# Altium schematic sheet keymap.SchDoc: Keymap Layout
size A3; Author: Daniele Basile <asterix24@gmail.com>; Organization: Altium Limited; Address1: L3, 12a Rodborough Rd; Address2: Frenchs Forest; Address3: NSW; Address4: Australia 2086; DocumentNumber: 2; Revision: Rev.A; SheetNumber: 2; SheetTotal: 2
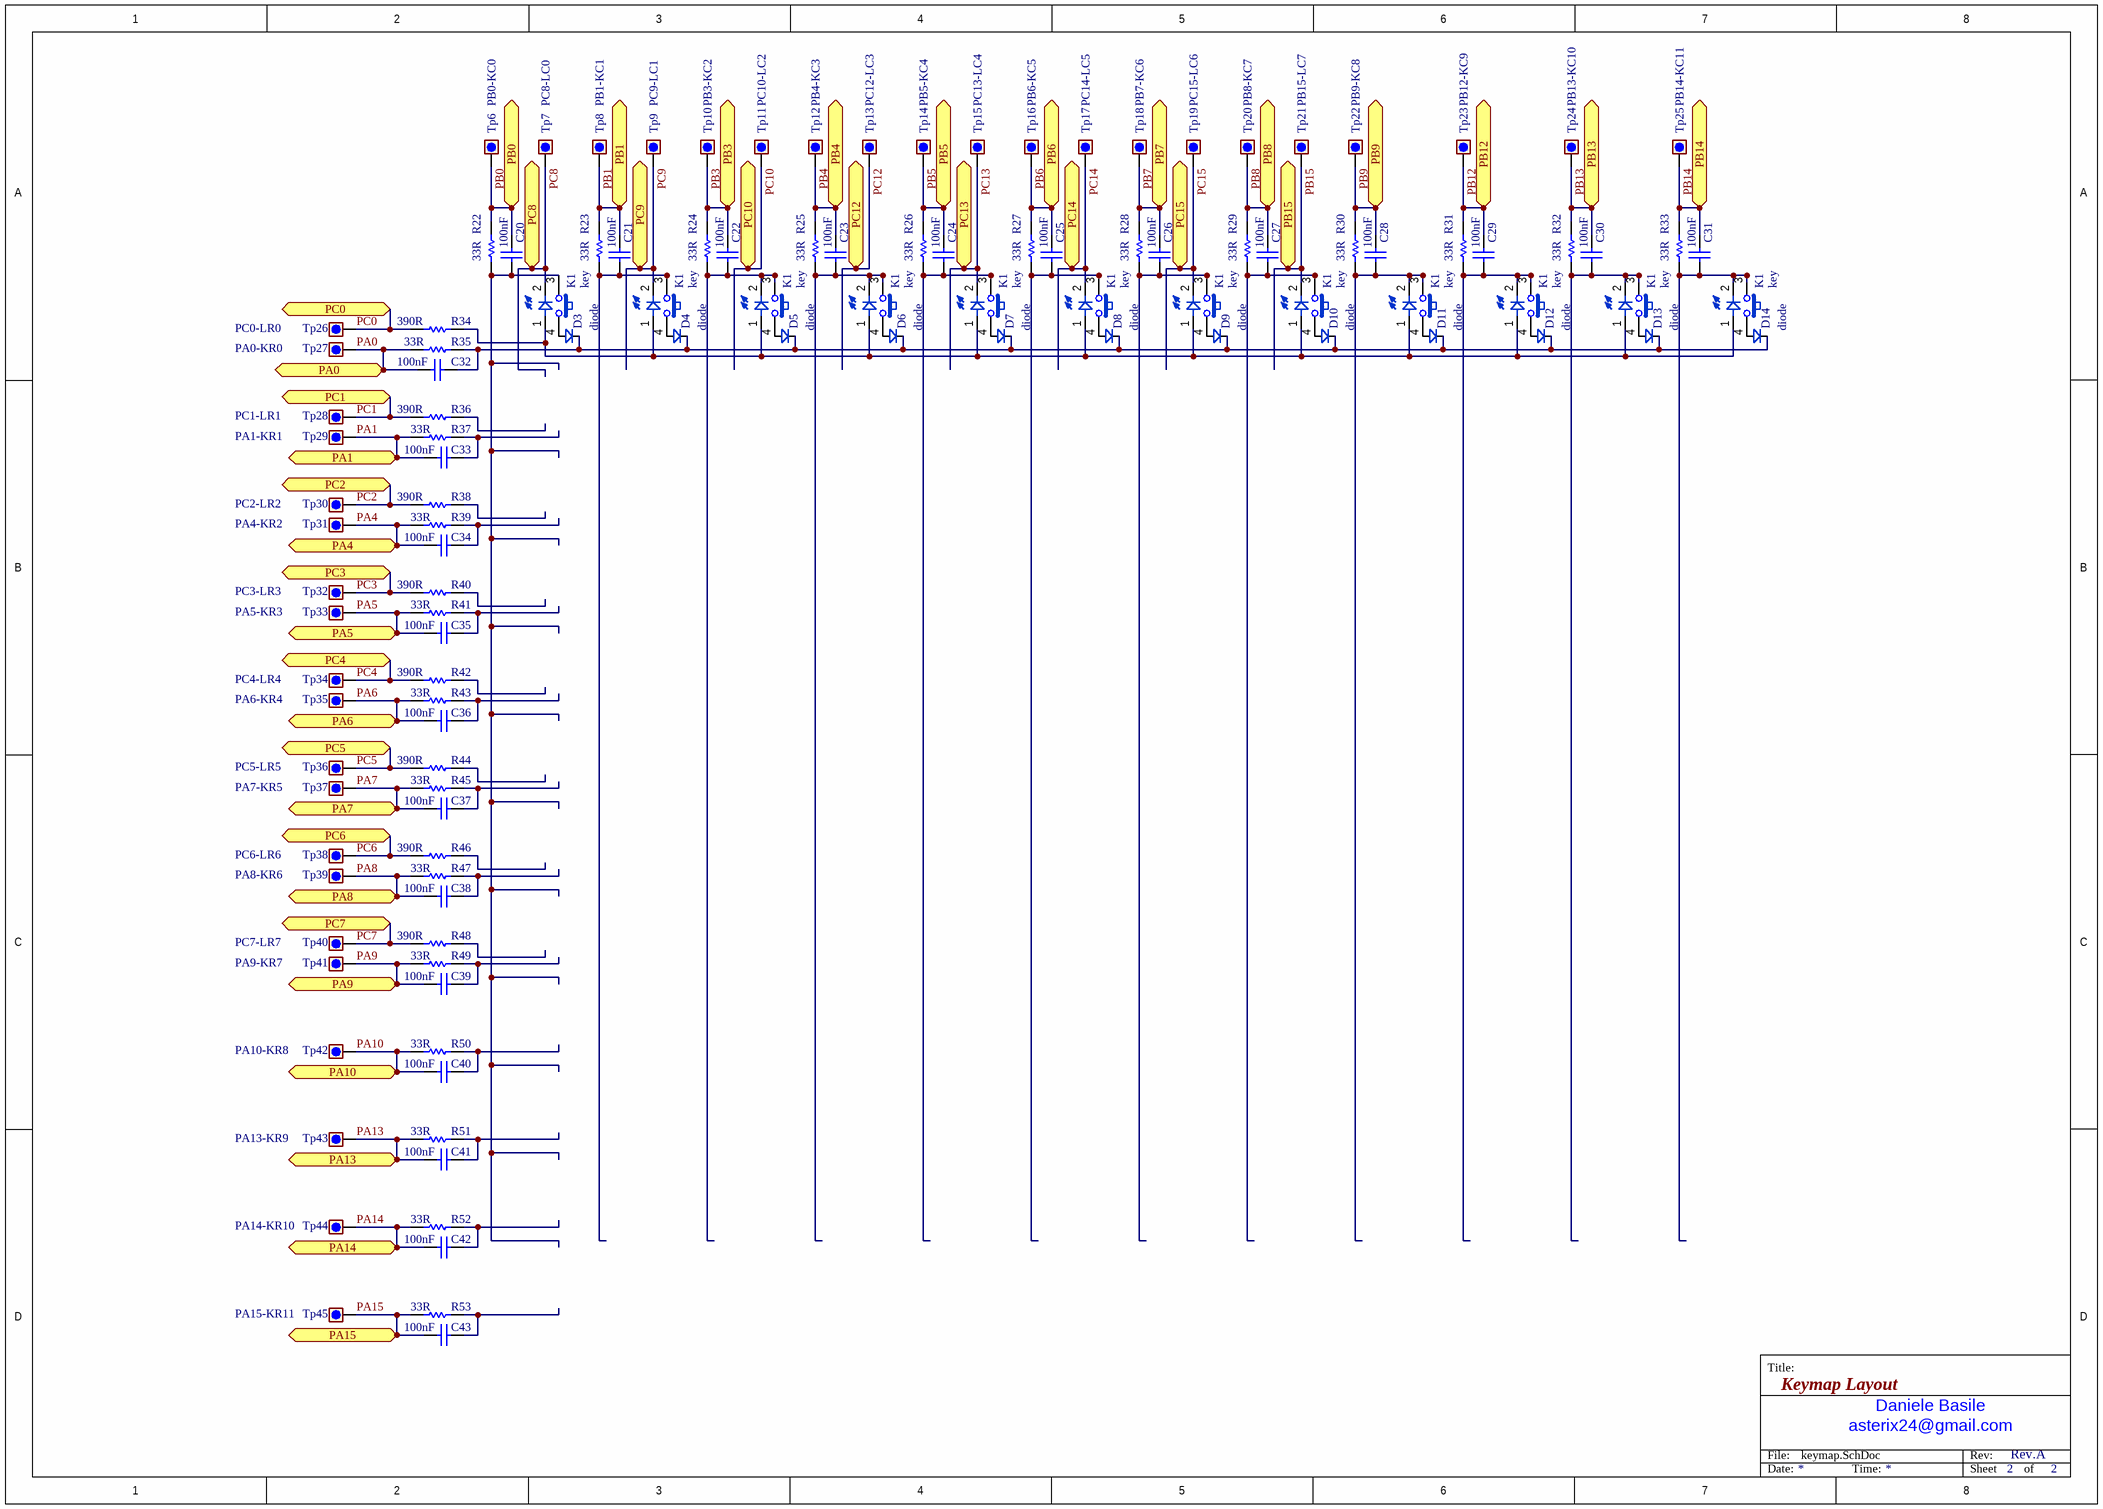
[diagram p0: keymap.SchDoc]

## Parts
(Parts that share a designator on the sheet are numbered #1, #2 ... from top to bottom, then left to right.)
C20  100nF  [0603_[1608]]
C21  100nF  [0603_[1608]]
C22  100nF  [0603_[1608]]
C23  100nF  [0603_[1608]]
C24  100nF  [0603_[1608]]
C25  100nF  [0603_[1608]]
C26  100nF  [0603_[1608]]
C27  100nF  [0603_[1608]]
C28  100nF  [0603_[1608]]
C29  100nF  [0603_[1608]]
C30  100nF  [0603_[1608]]
C31  100nF  [0603_[1608]]
C32  100nF  [0603_[1608]]
C33  100nF  [0603_[1608]]
C34  100nF  [0603_[1608]]
C35  100nF  [0603_[1608]]
C36  100nF  [0603_[1608]]
C37  100nF  [0603_[1608]]
C38  100nF  [0603_[1608]]
C39  100nF  [0603_[1608]]
C40  100nF  [0603_[1608]]
C41  100nF  [0603_[1608]]
C42  100nF  [0603_[1608]]
C43  100nF  [0603_[1608]]
D3  diode
D4  diode
D5  diode
D6  diode
D7  diode
D8  diode
D9  diode
D10  diode
D11  diode
D12  diode
D13  diode
D14  diode
K1#1  key  [CherryMx-switch]
K1#2  key  [CherryMx-switch]
K1#3  key  [CherryMx-switch]
K1#4  key  [CherryMx-switch]
K1#5  key  [CherryMx-switch]
K1#6  key  [CherryMx-switch]
K1#7  key  [CherryMx-switch]
K1#8  key  [CherryMx-switch]
K1#9  key  [CherryMx-switch]
K1#10  key  [CherryMx-switch]
K1#11  key  [CherryMx-switch]
K1#12  key  [CherryMx-switch]
R22  33R  [0603_[1608]]
R23  33R  [0603_[1608]]
R24  33R  [0603_[1608]]
R25  33R  [0603_[1608]]
R26  33R  [0603_[1608]]
R27  33R  [0603_[1608]]
R28  33R  [0603_[1608]]
R29  33R  [0603_[1608]]
R30  33R  [0603_[1608]]
R31  33R  [0603_[1608]]
R32  33R  [0603_[1608]]
R33  33R  [0603_[1608]]
R34  390R  [0603_[1608]]
R35  33R  [0603_[1608]]
R36  390R  [0603_[1608]]
R37  33R  [0603_[1608]]
R38  390R  [0603_[1608]]
R39  33R  [0603_[1608]]
R40  390R  [0603_[1608]]
R41  33R  [0603_[1608]]
R42  390R  [0603_[1608]]
R43  33R  [0603_[1608]]
R44  390R  [0603_[1608]]
R45  33R  [0603_[1608]]
R46  390R  [0603_[1608]]
R47  33R  [0603_[1608]]
R48  390R  [0603_[1608]]
R49  33R  [0603_[1608]]
R50  33R  [0603_[1608]]
R51  33R  [0603_[1608]]
R52  33R  [0603_[1608]]
R53  33R  [0603_[1608]]
Tp6  PB0-KC0  [TEST_POINT_THD_D1.8MM]  (no BOM)
Tp7  PC8-LC0  [TEST_POINT_THD_D1.8MM]  (no BOM)
Tp8  PB1-KC1  [TEST_POINT_THD_D1.8MM]  (no BOM)
Tp9  PC9-LC1  [TEST_POINT_THD_D1.8MM]  (no BOM)
Tp10  PB3-KC2  [TEST_POINT_THD_D1.8MM]  (no BOM)
Tp11  PC10-LC2  [TEST_POINT_THD_D1.8MM]  (no BOM)
Tp12  PB4-KC3  [TEST_POINT_THD_D1.8MM]  (no BOM)
Tp13  PC12-LC3  [TEST_POINT_THD_D1.8MM]  (no BOM)
Tp14  PB5-KC4  [TEST_POINT_THD_D1.8MM]  (no BOM)
Tp15  PC13-LC4  [TEST_POINT_THD_D1.8MM]  (no BOM)
Tp16  PB6-KC5  [TEST_POINT_THD_D1.8MM]  (no BOM)
Tp17  PC14-LC5  [TEST_POINT_THD_D1.8MM]  (no BOM)
Tp18  PB7-KC6  [TEST_POINT_THD_D1.8MM]  (no BOM)
Tp19  PC15-LC6  [TEST_POINT_THD_D1.8MM]  (no BOM)
Tp20  PB8-KC7  [TEST_POINT_THD_D1.8MM]  (no BOM)
Tp21  PB15-LC7  [TEST_POINT_THD_D1.8MM]  (no BOM)
Tp22  PB9-KC8  [TEST_POINT_THD_D1.8MM]  (no BOM)
Tp23  PB12-KC9  [TEST_POINT_THD_D1.8MM]  (no BOM)
Tp24  PB13-KC10  [TEST_POINT_THD_D1.8MM]  (no BOM)
Tp25  PB14-KC11  [TEST_POINT_THD_D1.8MM]  (no BOM)
Tp26  PC0-LR0  [TEST_POINT_THD_D1.8MM]  (no BOM)
Tp27  PA0-KR0  [TEST_POINT_THD_D1.8MM]  (no BOM)
Tp28  PC1-LR1  [TEST_POINT_THD_D1.8MM]  (no BOM)
Tp29  PA1-KR1  [TEST_POINT_THD_D1.8MM]  (no BOM)
Tp30  PC2-LR2  [TEST_POINT_THD_D1.8MM]  (no BOM)
Tp31  PA4-KR2  [TEST_POINT_THD_D1.8MM]  (no BOM)
Tp32  PC3-LR3  [TEST_POINT_THD_D1.8MM]  (no BOM)
Tp33  PA5-KR3  [TEST_POINT_THD_D1.8MM]  (no BOM)
Tp34  PC4-LR4  [TEST_POINT_THD_D1.8MM]  (no BOM)
Tp35  PA6-KR4  [TEST_POINT_THD_D1.8MM]  (no BOM)
Tp36  PC5-LR5  [TEST_POINT_THD_D1.8MM]  (no BOM)
Tp37  PA7-KR5  [TEST_POINT_THD_D1.8MM]  (no BOM)
Tp38  PC6-LR6  [TEST_POINT_THD_D1.8MM]  (no BOM)
Tp39  PA8-KR6  [TEST_POINT_THD_D1.8MM]  (no BOM)
Tp40  PC7-LR7  [TEST_POINT_THD_D1.8MM]  (no BOM)
Tp41  PA9-KR7  [TEST_POINT_THD_D1.8MM]  (no BOM)
Tp42  PA10-KR8  [TEST_POINT_THD_D1.8MM]  (no BOM)
Tp43  PA13-KR9  [TEST_POINT_THD_D1.8MM]  (no BOM)
Tp44  PA14-KR10  [TEST_POINT_THD_D1.8MM]  (no BOM)
Tp45  PA15-KR11  [TEST_POINT_THD_D1.8MM]  (no BOM)

## Ports
PA0, PA1, PA4, PA5, PA6, PA7, PA8, PA9, PA10, PA13, PA14, PA15, PB0, PB1, PB3, PB4, PB5, PB6, PB7, PB8, PB9, PB12, PB13, PB14, PB15, PC0, PC1, PC2, PC3, PC4, PC5, PC6, PC7, PC8, PC9, PC10, PC12, PC13, PC14, PC15

## Nets
PA0: C32.1 R35.1 Tp27.1 ; port PA0
PA1: C33.1 R37.1 Tp29.1 ; port PA1
PA4: C34.1 R39.1 Tp31.1 ; port PA4
PA5: C35.1 R41.1 Tp33.1 ; port PA5
PA6: C36.1 R43.1 Tp35.1 ; port PA6
PA7: C37.1 R45.1 Tp37.1 ; port PA7
PA8: C38.1 R47.1 Tp39.1 ; port PA8
PA9: C39.1 R49.1 Tp41.1 ; port PA9
PA10: C40.1 R50.1 Tp42.1 ; port PA10
PA13: C41.1 R51.1 Tp43.1 ; port PA13
PA14: C42.1 R52.1 Tp44.1 ; port PA14
PA15: C43.1 R53.1 Tp45.1 ; port PA15
PB0: C20.1 R22.1 Tp6.1 ; port PB0
PB1: C21.1 R23.1 Tp8.1 ; port PB1
PB3: C22.1 R24.1 Tp10.1 ; port PB3
PB4: C23.1 R25.1 Tp12.1 ; port PB4
PB5: C24.1 R26.1 Tp14.1 ; port PB5
PB6: C25.1 R27.1 Tp16.1 ; port PB6
PB7: C26.1 R28.1 Tp18.1 ; port PB7
PB8: C27.1 R29.1 Tp20.1 ; port PB8
PB9: C28.1 R30.1 Tp22.1 ; port PB9
PB12: C29.1 R31.1 Tp23.1 ; port PB12
PB13: C30.1 R32.1 Tp24.1 ; port PB13
PB14: C31.1 R33.1 Tp25.1 ; port PB14
PB15: K1#8.2 Tp21.1 ; port PB15
PC0: R34.1 Tp26.1 ; port PC0
PC1: R36.1 Tp28.1 ; port PC1
PC2: R38.1 Tp30.1 ; port PC2
PC3: R40.1 Tp32.1 ; port PC3
PC4: R42.1 Tp34.1 ; port PC4
PC5: R44.1 Tp36.1 ; port PC5
PC6: R46.1 Tp38.1 ; port PC6
PC7: R48.1 Tp40.1 ; port PC7
PC8: K1#1.2 Tp7.1 ; port PC8
PC9: K1#2.2 Tp9.1 ; port PC9
PC10: Tp11.1 ; port PC10
PC12: Tp13.1 ; port PC12
PC13: K1#5.2 Tp15.1 ; port PC13
PC14: K1#6.2 Tp17.1 ; port PC14
PC15: K1#7.2 Tp19.1 ; port PC15
NetC20_2: C20.2 K1#1.3 R22.2
NetC21_2: C21.2 K1#2.3 R23.2
NetC22_2: C22.2 K1#3.2 K1#3.3 R24.2
NetC23_2: C23.2 K1#4.2 K1#4.3 R25.2
NetC24_2: C24.2 K1#5.3 R26.2
NetC25_2: C25.2 K1#6.3 R27.2
NetC26_2: C26.2 K1#7.3 R28.2
NetC27_2: C27.2 K1#8.3 R29.2
NetC28_2: C28.2 K1#9.2 K1#9.3 R30.2
NetC29_2: C29.2 K1#10.2 K1#10.3 R31.2
NetC30_2: C30.2 K1#11.2 K1#11.3 R32.2
NetC31_2: C31.2 K1#12.2 K1#12.3 R33.2
NetC32_2: C32.2 D3.2(K) D4.2(K) D5.2(K) D6.2(K) D7.2(K) D8.2(K) D9.2(K) D10.2(K) D11.2(K) D12.2(K) D13.2(K) D14.2(K) R35.2
NetC33_2: C33.2 R37.2
NetC34_2: C34.2 R39.2
NetC35_2: C35.2 R41.2
NetC36_2: C36.2 R43.2
NetC37_2: C37.2 R45.2
NetC38_2: C38.2 R47.2
NetC39_2: C39.2 R49.2
NetC40_2: C40.2 R50.2
NetC41_2: C41.2 R51.2
NetC42_2: C42.2 R52.2
NetC43_2: C43.2 R53.2
NetD3_1: D3.1(A) K1#1.4
NetD4_1: D4.1(A) K1#2.4
NetD5_1: D5.1(A) K1#3.4
NetD6_1: D6.1(A) K1#4.4
NetD7_1: D7.1(A) K1#5.4
NetD8_1: D8.1(A) K1#6.4
NetD9_1: D9.1(A) K1#7.4
NetD10_1: D10.1(A) K1#8.4
NetD11_1: D11.1(A) K1#9.4
NetD12_1: D12.1(A) K1#10.4
NetD13_1: D13.1(A) K1#11.4
NetD14_1: D14.1(A) K1#12.4
NetK1#1_1: K1#1.1 K1#2.1 K1#3.1 K1#4.1 K1#5.1 K1#6.1 K1#7.1 K1#8.1 K1#9.1 K1#10.1 K1#11.1 K1#12.1 R34.2

Not connected (* = marked no-connect by the designer): R36 2; R38 2; R40 2; R42 2; R44 2; R46 2; R48 2

## Notes on the sheet
- Title:
- File:
- asterix24@gmail.com
- Daniele Basile
- Rev:
- Date:
- Time:
- Sheet
- of

## Library data of the parts
C20-C43 = Cap: Ceramic X7R 50V; Value: 10nF; Published: 8-Jun-2000; Revision: July-2002: Re-released for DXP Platform.; Publisher: Altium Limited
D3-D14 = diode_small
K1#1-K1#12 = keybutton_cherryMX: CherryMx key button.
R22-R53 = Res1: Resistor; Value: 1K; Published: 8-Jun-2000; Revision: July-2002: Re-released for DXP Platform.; Publisher: Altium Limited
Tp6-Tp45 = Test_point: Test point